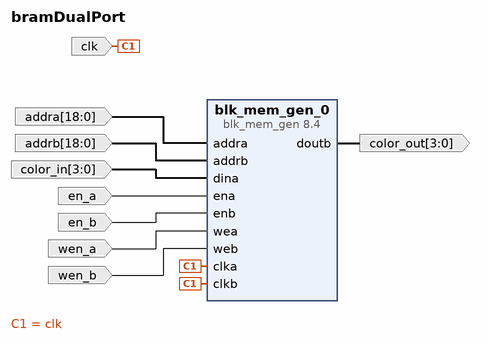
[diagram p0: block diagram of the top level]
# Vivado block design bramDualPort, xc7a100tcsg324-1, Vivado 2020.2
create_bd_design bramDualPort

create_bd_port -dir I -from 18 -to 0 addra
create_bd_port -dir I -from 18 -to 0 addrb
create_bd_port -dir I clk
create_bd_port -dir I -from 3 -to 0 color_in
create_bd_port -dir I en_a
create_bd_port -dir I en_b
create_bd_port -dir I wen_a
create_bd_port -dir O -from 3 -to 0 color_out
create_bd_port -dir I wen_b

create_bd_cell -type ip -vlnv xilinx.com:ip:blk_mem_gen:8.4 blk_mem_gen_0
set_property -dict [list \
  CONFIG.Enable_32bit_Address false \
  CONFIG.Enable_B Use_ENB_Pin \
  CONFIG.Fill_Remaining_Memory_Locations true \
  CONFIG.Load_Init_File false \
  CONFIG.Memory_Type True_Dual_Port_RAM \
  CONFIG.Port_B_Clock 100 \
  CONFIG.Port_B_Enable_Rate 100 \
  CONFIG.Port_B_Write_Rate 50 \
  CONFIG.Read_Width_A 4 \
  CONFIG.Read_Width_B 4 \
  CONFIG.Register_PortA_Output_of_Memory_Primitives true \
  CONFIG.Register_PortB_Output_of_Memory_Primitives true \
  CONFIG.Use_Byte_Write_Enable false \
  CONFIG.Use_RSTA_Pin false \
  CONFIG.Write_Depth_A 307200 \
  CONFIG.Write_Width_A 4 \
  CONFIG.Write_Width_B 4 \
  CONFIG.use_bram_block Stand_Alone \
] [get_bd_cells blk_mem_gen_0]

# ---- connections ----

connect_bd_net [get_bd_ports addra] [get_bd_pins blk_mem_gen_0/addra]
connect_bd_net [get_bd_ports addrb] [get_bd_pins blk_mem_gen_0/addrb]
connect_bd_net [get_bd_ports clk] [get_bd_pins blk_mem_gen_0/clka] [get_bd_pins blk_mem_gen_0/clkb]
connect_bd_net [get_bd_ports color_in] [get_bd_pins blk_mem_gen_0/dina]
connect_bd_net [get_bd_ports en_a] [get_bd_pins blk_mem_gen_0/ena]
connect_bd_net [get_bd_ports en_b] [get_bd_pins blk_mem_gen_0/enb]
connect_bd_net -net we_a_1 [get_bd_ports wen_a] [get_bd_pins blk_mem_gen_0/wea]
connect_bd_net [get_bd_pins blk_mem_gen_0/doutb] [get_bd_ports color_out]
connect_bd_net -net we_b_1 [get_bd_ports wen_b] [get_bd_pins blk_mem_gen_0/web]

validate_bd_design
save_bd_design
